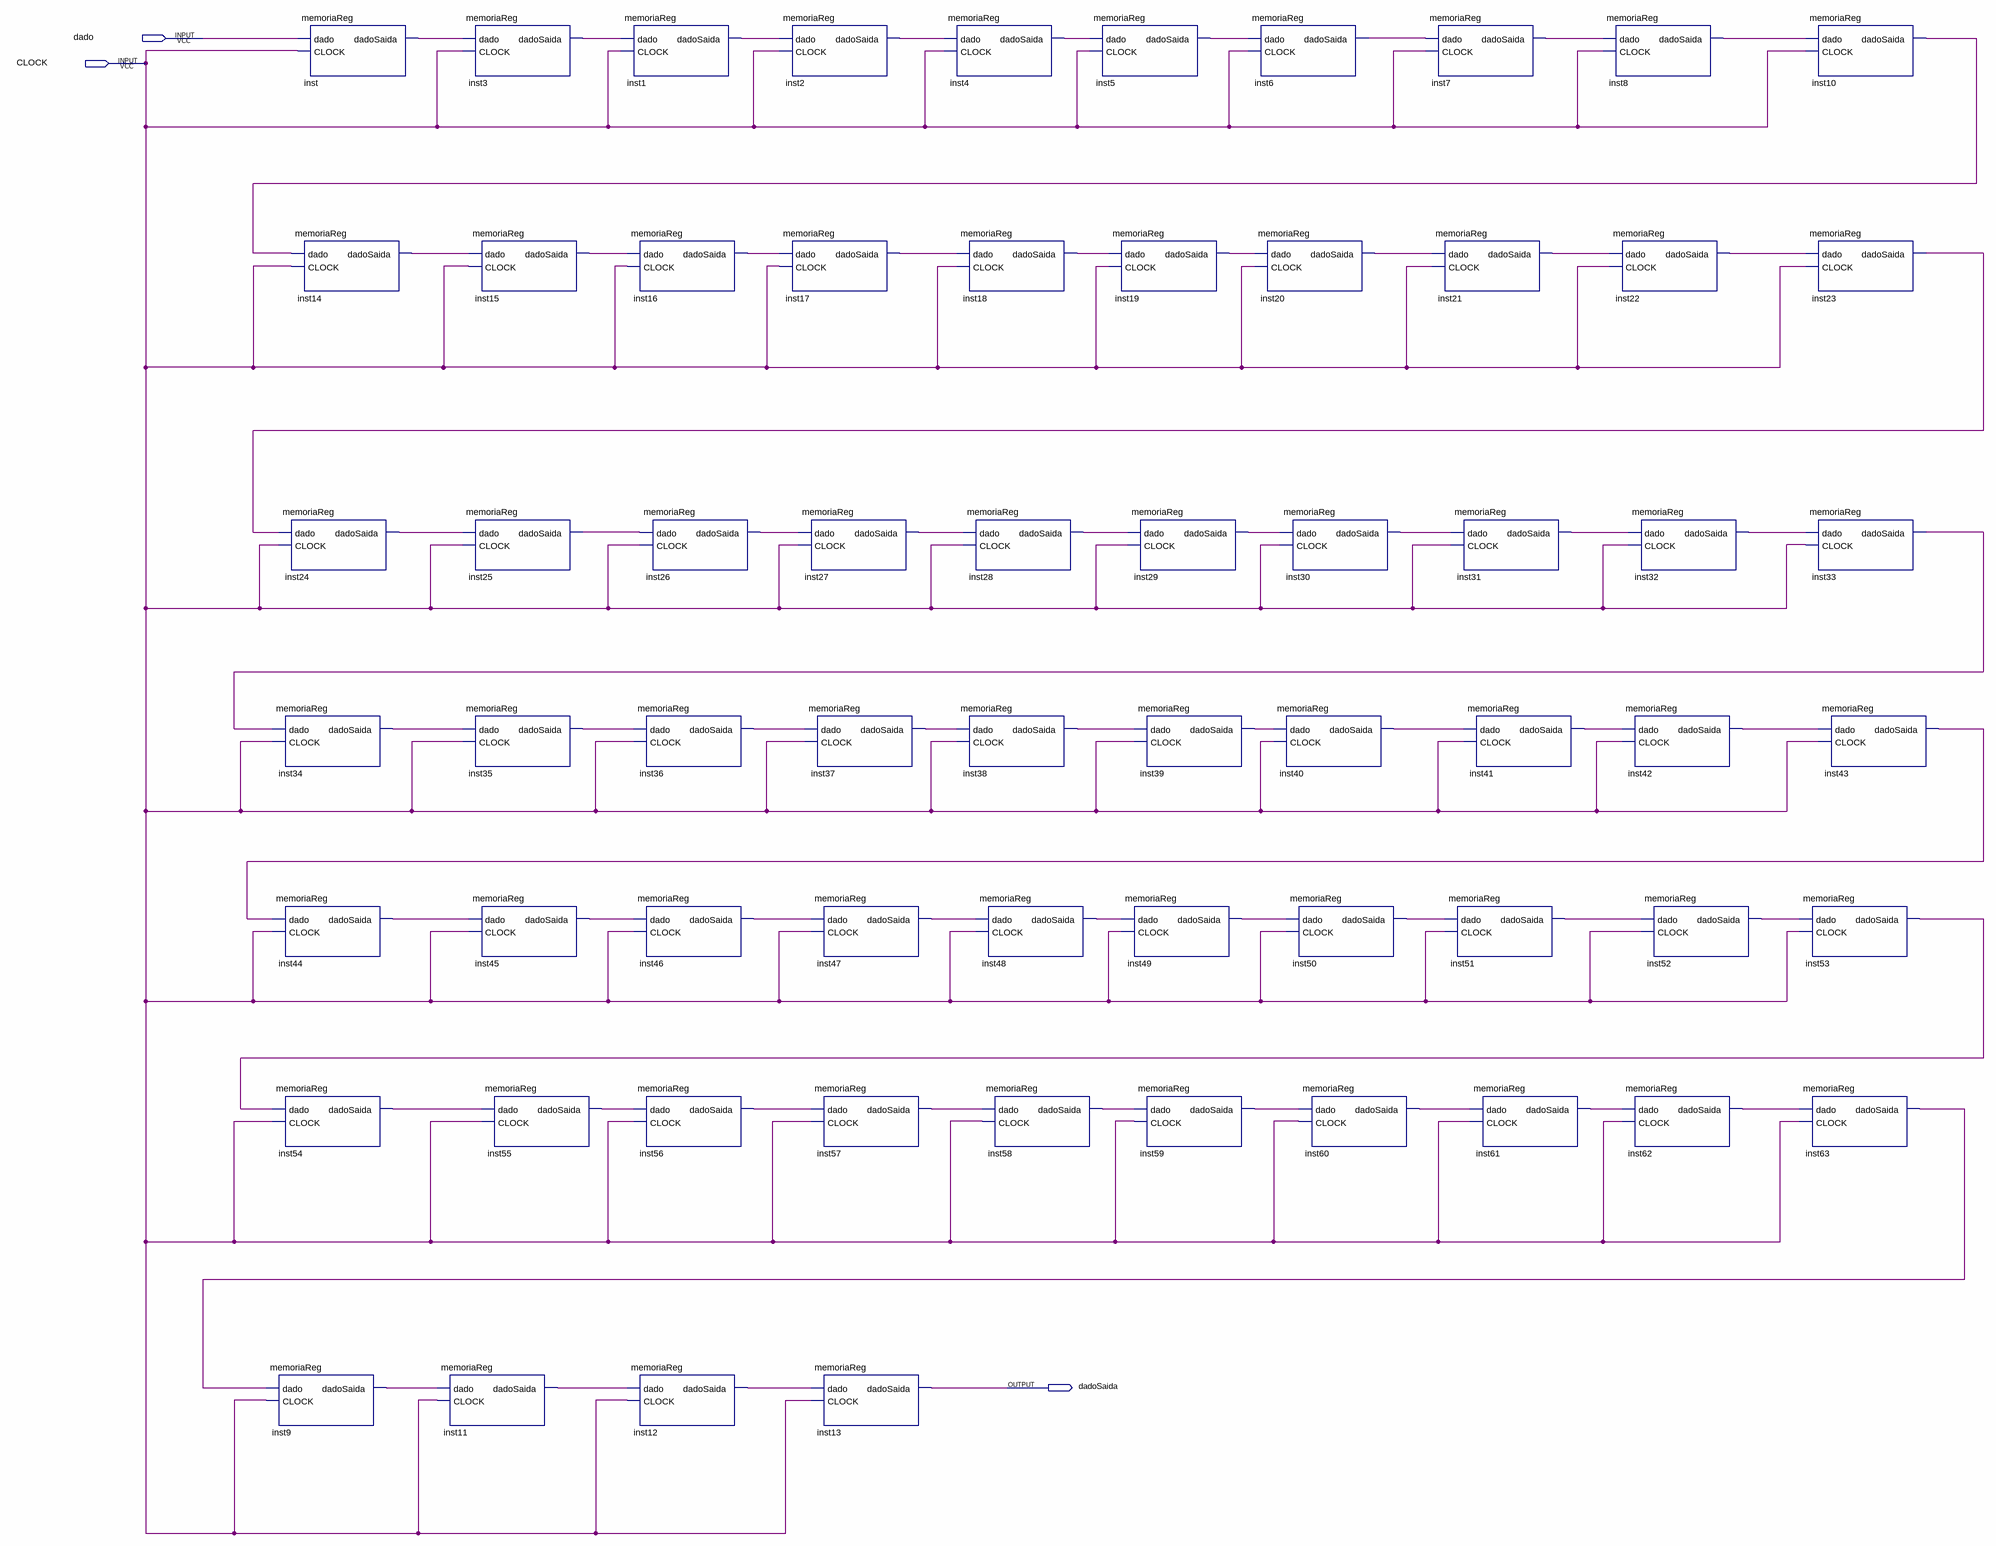
[diagram p0: schematic sheet]
// Quartus schematic Block1.bdf as structural Verilog: 64 symbols, 3 pins
module Block1 (
  input  dado,
  input  CLOCK,
  output dadoSaida
);

  wire inst1_dadosaida, inst2_dadosaida, inst3_dadosaida, inst4_dadosaida, inst5_dadosaida, inst6_dadosaida,
       inst7_dadosaida, inst8_dadosaida, inst9_dadosaida, inst10_dadosaida, inst11_dadosaida,
       inst12_dadosaida, inst14_dadosaida, inst15_dadosaida, inst16_dadosaida, inst17_dadosaida,
       inst18_dadosaida, inst19_dadosaida, inst20_dadosaida, inst21_dadosaida, inst22_dadosaida,
       inst23_dadosaida, inst24_dadosaida, inst25_dadosaida, inst26_dadosaida, inst27_dadosaida,
       inst28_dadosaida, inst29_dadosaida, inst30_dadosaida, inst31_dadosaida, inst32_dadosaida,
       inst33_dadosaida, inst34_dadosaida, inst35_dadosaida, inst36_dadosaida, inst37_dadosaida,
       inst38_dadosaida, inst39_dadosaida, inst40_dadosaida, inst41_dadosaida, inst42_dadosaida,
       inst43_dadosaida, inst44_dadosaida, inst45_dadosaida, inst46_dadosaida, inst47_dadosaida,
       inst48_dadosaida, inst49_dadosaida, inst50_dadosaida, inst51_dadosaida, inst52_dadosaida,
       inst53_dadosaida, inst54_dadosaida, inst55_dadosaida, inst56_dadosaida, inst57_dadosaida,
       inst58_dadosaida, inst59_dadosaida, inst60_dadosaida, inst61_dadosaida, inst62_dadosaida,
       inst63_dadosaida, inst_dadosaida;

  memoriaReg inst14 (.dado(inst10_dadosaida), .CLOCK(CLOCK), .dadoSaida(inst14_dadosaida));
  memoriaReg inst24 (.dado(inst23_dadosaida), .CLOCK(CLOCK), .dadoSaida(inst24_dadosaida));
  memoriaReg inst34 (.dado(inst33_dadosaida), .CLOCK(CLOCK), .dadoSaida(inst34_dadosaida));
  memoriaReg inst44 (.dado(inst43_dadosaida), .CLOCK(CLOCK), .dadoSaida(inst44_dadosaida));
  memoriaReg inst54 (.dado(inst53_dadosaida), .CLOCK(CLOCK), .dadoSaida(inst54_dadosaida));
  memoriaReg inst9 (.dado(inst63_dadosaida), .CLOCK(CLOCK), .dadoSaida(inst9_dadosaida));
  memoriaReg inst (.dado(dado), .CLOCK(CLOCK), .dadoSaida(inst_dadosaida));
  memoriaReg inst11 (.dado(inst9_dadosaida), .CLOCK(CLOCK), .dadoSaida(inst11_dadosaida));
  memoriaReg inst3 (.dado(inst_dadosaida), .CLOCK(CLOCK), .dadoSaida(inst3_dadosaida));
  memoriaReg inst15 (.dado(inst14_dadosaida), .CLOCK(CLOCK), .dadoSaida(inst15_dadosaida));
  memoriaReg inst25 (.dado(inst24_dadosaida), .CLOCK(CLOCK), .dadoSaida(inst25_dadosaida));
  memoriaReg inst35 (.dado(inst34_dadosaida), .CLOCK(CLOCK), .dadoSaida(inst35_dadosaida));
  memoriaReg inst45 (.dado(inst44_dadosaida), .CLOCK(CLOCK), .dadoSaida(inst45_dadosaida));
  memoriaReg inst55 (.dado(inst54_dadosaida), .CLOCK(CLOCK), .dadoSaida(inst55_dadosaida));
  memoriaReg inst1 (.dado(inst3_dadosaida), .CLOCK(CLOCK), .dadoSaida(inst1_dadosaida));
  memoriaReg inst16 (.dado(inst15_dadosaida), .CLOCK(CLOCK), .dadoSaida(inst16_dadosaida));
  memoriaReg inst26 (.dado(inst25_dadosaida), .CLOCK(CLOCK), .dadoSaida(inst26_dadosaida));
  memoriaReg inst36 (.dado(inst35_dadosaida), .CLOCK(CLOCK), .dadoSaida(inst36_dadosaida));
  memoriaReg inst46 (.dado(inst45_dadosaida), .CLOCK(CLOCK), .dadoSaida(inst46_dadosaida));
  memoriaReg inst56 (.dado(inst55_dadosaida), .CLOCK(CLOCK), .dadoSaida(inst56_dadosaida));
  memoriaReg inst12 (.dado(inst11_dadosaida), .CLOCK(CLOCK), .dadoSaida(inst12_dadosaida));
  memoriaReg inst2 (.dado(inst1_dadosaida), .CLOCK(CLOCK), .dadoSaida(inst2_dadosaida));
  memoriaReg inst17 (.dado(inst16_dadosaida), .CLOCK(CLOCK), .dadoSaida(inst17_dadosaida));
  memoriaReg inst27 (.dado(inst26_dadosaida), .CLOCK(CLOCK), .dadoSaida(inst27_dadosaida));
  memoriaReg inst37 (.dado(inst36_dadosaida), .CLOCK(CLOCK), .dadoSaida(inst37_dadosaida));
  memoriaReg inst47 (.dado(inst46_dadosaida), .CLOCK(CLOCK), .dadoSaida(inst47_dadosaida));
  memoriaReg inst57 (.dado(inst56_dadosaida), .CLOCK(CLOCK), .dadoSaida(inst57_dadosaida));
  memoriaReg inst13 (.dado(inst12_dadosaida), .CLOCK(CLOCK), .dadoSaida(dadoSaida));
  memoriaReg inst4 (.dado(inst2_dadosaida), .CLOCK(CLOCK), .dadoSaida(inst4_dadosaida));
  memoriaReg inst18 (.dado(inst17_dadosaida), .CLOCK(CLOCK), .dadoSaida(inst18_dadosaida));
  memoriaReg inst28 (.dado(inst27_dadosaida), .CLOCK(CLOCK), .dadoSaida(inst28_dadosaida));
  memoriaReg inst38 (.dado(inst37_dadosaida), .CLOCK(CLOCK), .dadoSaida(inst38_dadosaida));
  memoriaReg inst48 (.dado(inst47_dadosaida), .CLOCK(CLOCK), .dadoSaida(inst48_dadosaida));
  memoriaReg inst58 (.dado(inst57_dadosaida), .CLOCK(CLOCK), .dadoSaida(inst58_dadosaida));
  memoriaReg inst5 (.dado(inst4_dadosaida), .CLOCK(CLOCK), .dadoSaida(inst5_dadosaida));
  memoriaReg inst19 (.dado(inst18_dadosaida), .CLOCK(CLOCK), .dadoSaida(inst19_dadosaida));
  memoriaReg inst29 (.dado(inst28_dadosaida), .CLOCK(CLOCK), .dadoSaida(inst29_dadosaida));
  memoriaReg inst39 (.dado(inst38_dadosaida), .CLOCK(CLOCK), .dadoSaida(inst39_dadosaida));
  memoriaReg inst49 (.dado(inst48_dadosaida), .CLOCK(CLOCK), .dadoSaida(inst49_dadosaida));
  memoriaReg inst59 (.dado(inst58_dadosaida), .CLOCK(CLOCK), .dadoSaida(inst59_dadosaida));
  memoriaReg inst6 (.dado(inst5_dadosaida), .CLOCK(CLOCK), .dadoSaida(inst6_dadosaida));
  memoriaReg inst20 (.dado(inst19_dadosaida), .CLOCK(CLOCK), .dadoSaida(inst20_dadosaida));
  memoriaReg inst30 (.dado(inst29_dadosaida), .CLOCK(CLOCK), .dadoSaida(inst30_dadosaida));
  memoriaReg inst40 (.dado(inst39_dadosaida), .CLOCK(CLOCK), .dadoSaida(inst40_dadosaida));
  memoriaReg inst50 (.dado(inst49_dadosaida), .CLOCK(CLOCK), .dadoSaida(inst50_dadosaida));
  memoriaReg inst60 (.dado(inst59_dadosaida), .CLOCK(CLOCK), .dadoSaida(inst60_dadosaida));
  memoriaReg inst7 (.dado(inst6_dadosaida), .CLOCK(CLOCK), .dadoSaida(inst7_dadosaida));
  memoriaReg inst21 (.dado(inst20_dadosaida), .CLOCK(CLOCK), .dadoSaida(inst21_dadosaida));
  memoriaReg inst31 (.dado(inst30_dadosaida), .CLOCK(CLOCK), .dadoSaida(inst31_dadosaida));
  memoriaReg inst51 (.dado(inst50_dadosaida), .CLOCK(CLOCK), .dadoSaida(inst51_dadosaida));
  memoriaReg inst41 (.dado(inst40_dadosaida), .CLOCK(CLOCK), .dadoSaida(inst41_dadosaida));
  memoriaReg inst61 (.dado(inst60_dadosaida), .CLOCK(CLOCK), .dadoSaida(inst61_dadosaida));
  memoriaReg inst8 (.dado(inst7_dadosaida), .CLOCK(CLOCK), .dadoSaida(inst8_dadosaida));
  memoriaReg inst22 (.dado(inst21_dadosaida), .CLOCK(CLOCK), .dadoSaida(inst22_dadosaida));
  memoriaReg inst32 (.dado(inst31_dadosaida), .CLOCK(CLOCK), .dadoSaida(inst32_dadosaida));
  memoriaReg inst42 (.dado(inst41_dadosaida), .CLOCK(CLOCK), .dadoSaida(inst42_dadosaida));
  memoriaReg inst52 (.dado(inst51_dadosaida), .CLOCK(CLOCK), .dadoSaida(inst52_dadosaida));
  memoriaReg inst62 (.dado(inst61_dadosaida), .CLOCK(CLOCK), .dadoSaida(inst62_dadosaida));
  memoriaReg inst10 (.dado(inst8_dadosaida), .CLOCK(CLOCK), .dadoSaida(inst10_dadosaida));
  memoriaReg inst23 (.dado(inst22_dadosaida), .CLOCK(CLOCK), .dadoSaida(inst23_dadosaida));
  memoriaReg inst33 (.dado(inst32_dadosaida), .CLOCK(CLOCK), .dadoSaida(inst33_dadosaida));
  memoriaReg inst53 (.dado(inst52_dadosaida), .CLOCK(CLOCK), .dadoSaida(inst53_dadosaida));
  memoriaReg inst63 (.dado(inst62_dadosaida), .CLOCK(CLOCK), .dadoSaida(inst63_dadosaida));
  memoriaReg inst43 (.dado(inst42_dadosaida), .CLOCK(CLOCK), .dadoSaida(inst43_dadosaida));
endmodule
